# EAGLE design 4-port (EAGLE 7.6.0)
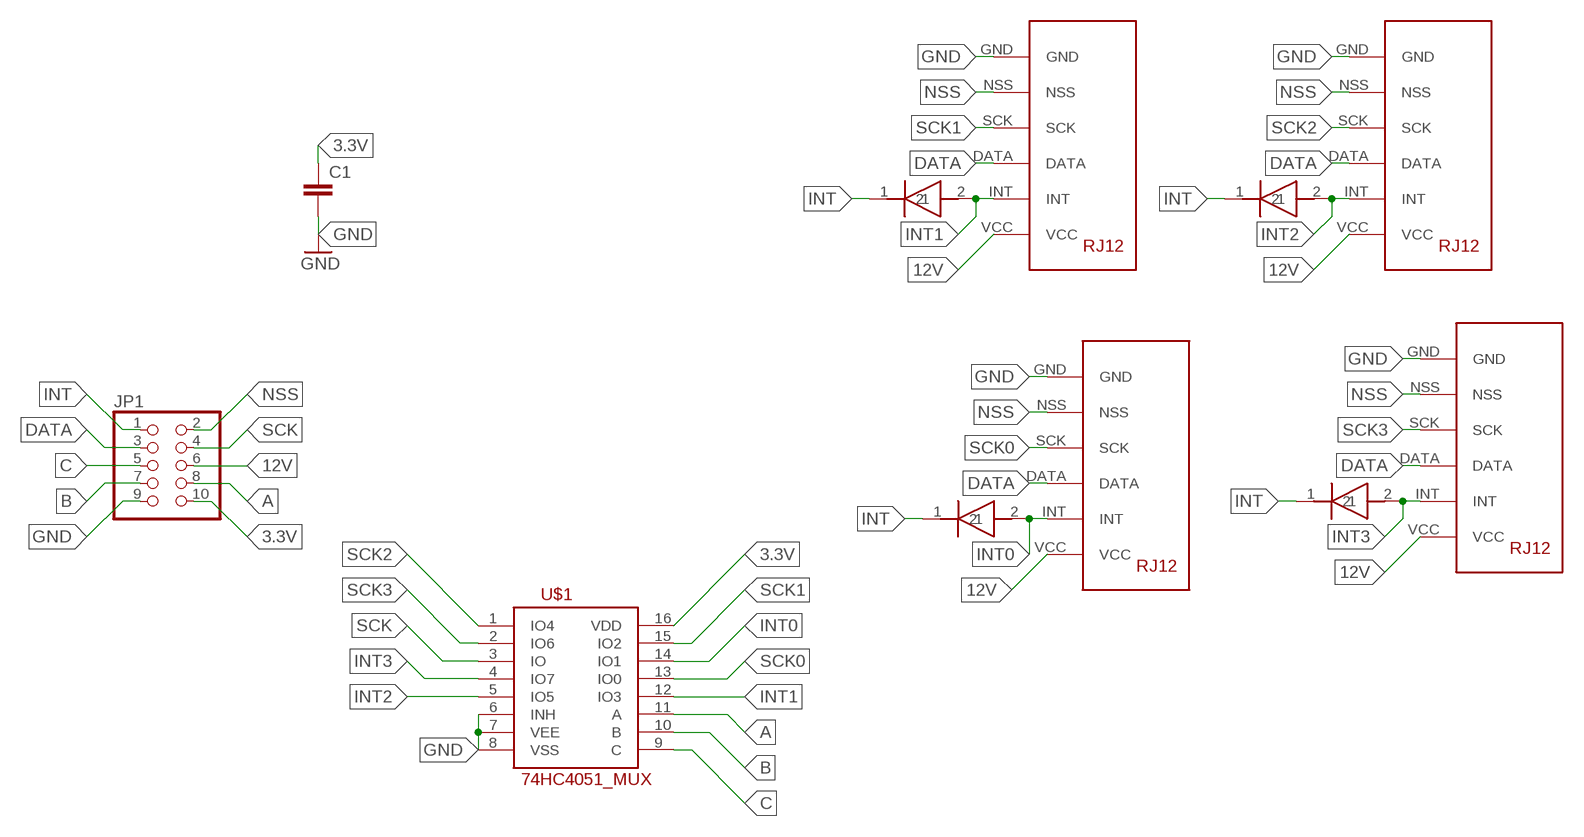
[diagram p0: schematic, sheet 1]

## Parts
C1  C-EUC1206  [C1206]
JP1  PINHD-2X5  [2X05]
U$1  74HC4051_MUX  [SO16]
U$2  RJ12SMD  [RJ12_SMD]
U$3  DIODE  [DIL_DIODE_SMD]
U$4  RJ12SMD  [RJ12_SMD]
U$5  RJ12SMD  [RJ12_SMD]
U$6  DIODE  [DIL_DIODE_SMD]
U$7  RJ12SMD  [RJ12_SMD]
U$8  DIODE  [DIL_DIODE_SMD]
U$9  DIODE  [DIL_DIODE_SMD]

## Nets
3.3V: C1.1 JP1.10 U$1.16(VDD)
12V: JP1.6 U$2.VCC U$4.VCC U$5.VCC U$7.VCC
A: JP1.8 U$1.11(A)
B: JP1.7 U$1.10(B)
C: JP1.5 U$1.9(C)
DATA: JP1.3 U$2.DATA U$4.DATA U$5.DATA U$7.DATA
GND: C1.2 JP1.9 U$1.6(INH) U$1.7(VEE) U$1.8(VSS) U$2.GND U$4.GND U$5.GND U$7.GND
INT: JP1.1 U$3.1 U$6.1 U$8.1 U$9.1
INT0: U$1.14(IO1) U$2.INT U$3.2
INT1: U$1.12(IO3) U$4.INT U$9.2
INT2: U$1.5(IO5) U$5.INT U$6.2
INT3: U$1.4(IO7) U$7.INT U$8.2
NSS: JP1.2 U$2.NSS U$4.NSS U$5.NSS U$7.NSS
SCK: JP1.4 U$1.3(IO)
SCK0: U$1.13(IO0) U$2.SCK
SCK1: U$1.15(IO2) U$4.SCK
SCK2: U$1.1(IO4) U$5.SCK
SCK3: U$1.2(IO6) U$7.SCK

## Library data of the parts
C1 = resistor:C-EU: CAPACITOR, European symbol
JP1 = pinhead:PINHD-2X5: PIN HEADER
U$1 = SparkFun-AnalogIC:74HC4051_MUX: 8:1 analog mux
U$2 U$4 U$5 U$7 = gumyns:RJ12
U$3 U$6 U$8 U$9 = gumyns:DIODE

## Board
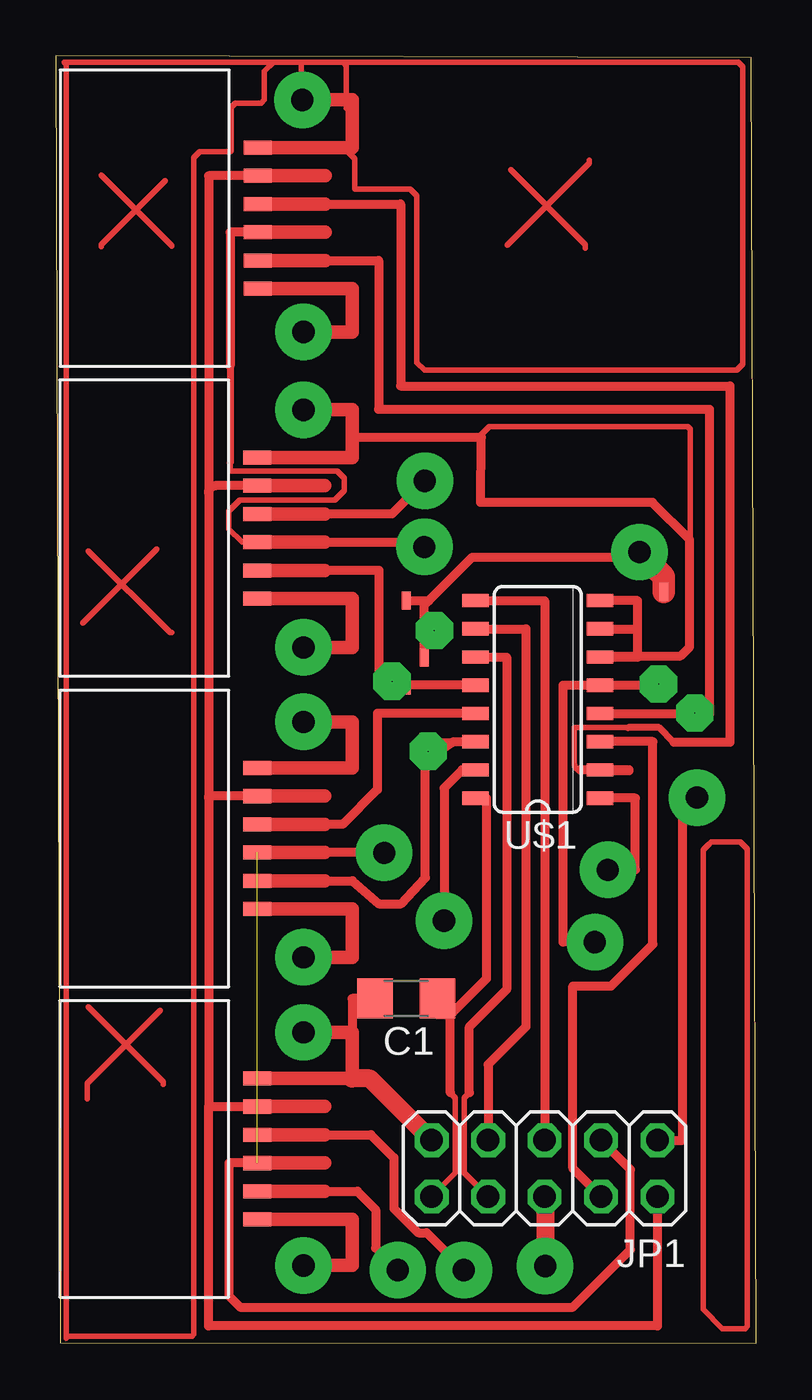
[diagram p1: board, top side]
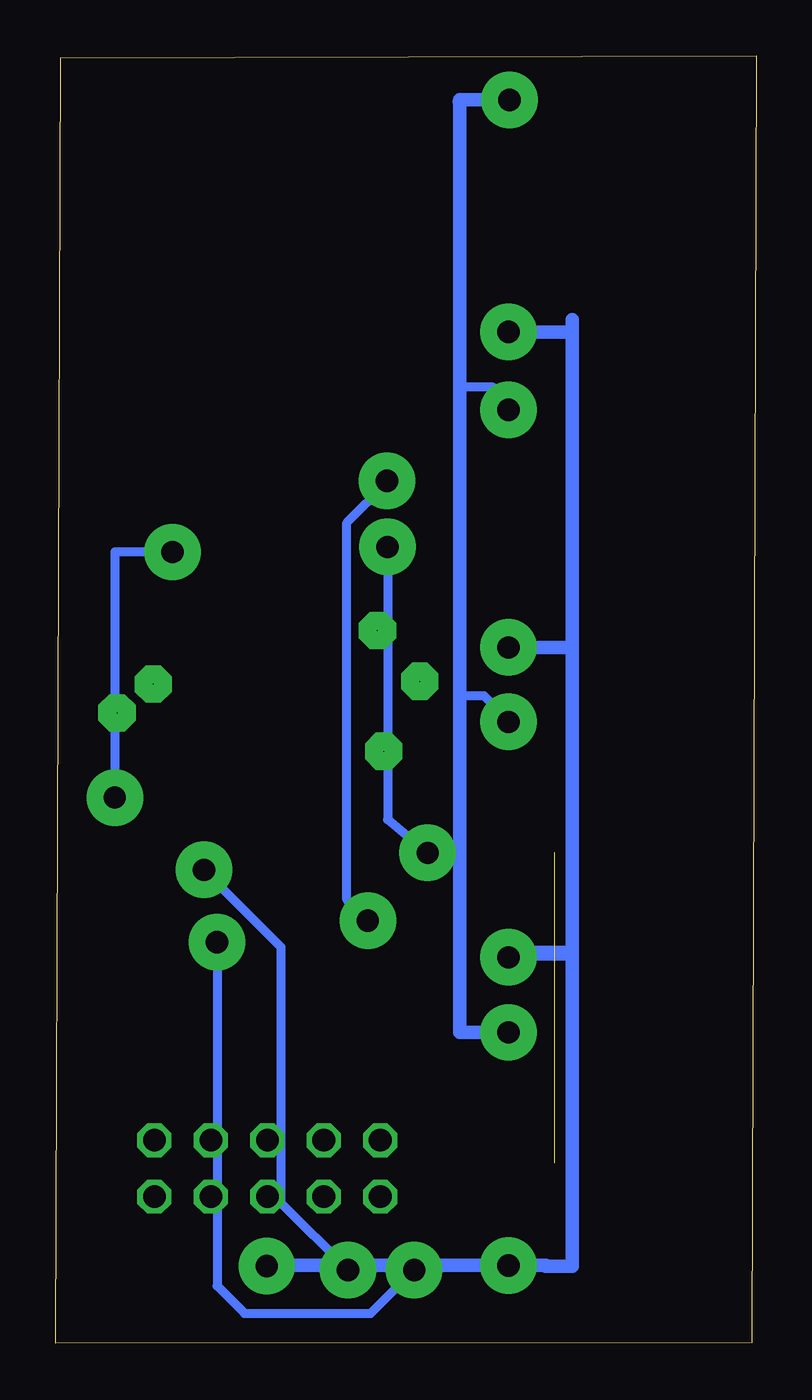
[diagram p2: board, bottom side, seen from below]

Size 31.52 x 57.95 mm. Coordinates in mm from the lower left corner, seen from the top.
Outline: 0.2,0.03 31.52,0 31.29,57.85 0,57.95 0.2,0.03
Copper layers (1*16): Top 0.035mm / dielectric 1.5mm / Bottom 0.035mm
Design rules "default": minimum track width 10mil, minimum drill 24mil, track to track 8mil, track to pad 8mil, pad to pad 8mil, via to via 8mil, smd to smd 8mil, copper to edge 40mil, drill to drill 8mil, minimum pad ring 10mil, minimum via ring 8mil, stop-mask expansion 4mil, vias tented up to drill 0mil, thermal gap 10mil

### Footprints (pad centres in the part's own frame; a part is rotated, then mirrored left to right if it is on the bottom)
C1206 = smd 1.6 x 1.8: 1 -1.4,0; 2 1.4,0
2X05 = drill 1.016 octagon: 1 -5.08,-1.27; 2 -5.08,1.27; 3 -2.54,-1.27; 4 -2.54,1.27; 5 0,-1.27; 6 0,1.27; 7 2.54,-1.27; 8 2.54,1.27; 9 5.08,-1.27; 10 5.08,1.27
SO16 = smd 0.6 x 1.2: 1 -4.445,-2.8; 2 -3.175,-2.8; 3 -1.905,-2.8; 4 -0.635,-2.8; 5 0.635,-2.8; 6 1.905,-2.8; 7 3.175,-2.8; 8 4.445,-2.8; 9 4.445,2.8; 10 3.175,2.8; 11 1.905,2.8; 12 0.635,2.8; 13 -0.635,2.8; 14 -1.905,2.8; 15 -3.175,2.8; 16 -4.445,2.8
RJ12_SMD = smd 0.635 x 1.27: DATA 0.953,5.08; GND -2.857,5.08; INT 2.223,5.08; NSS -1.587,5.08; SCK -0.318,5.08; VCC 3.493,5.08
DIL_DIODE_SMD = smd 0.406 x 0.813: 1 0,2.54; 2 0,-1.27

### Placement (x,y rotation side)
C1  15.77,15.52 180 top
JP1  22,7.87 180 top
U$1  21.69,28.98 90 top
U$2  3.99,23.04 270 top
U$3  16.59,28.32 0 top
U$4  3.99,37.01 270 top
U$5  3.99,9.07 270 top
U$6  27.36,31.27 0 top
U$7  4.01,50.95 270 top
U$8  28.22,27.05 180 top
U$9  15.77,30.89 0 top

### Tracks (layer width: path | path; a pad name or v marks a point on that pad's centre or on a via)
3.3V
  Top 0.254: JP1.10 17.98,7.67 17.98,11.05 17.75,11.28
  Top 0.406: U$1.16 19.38,24.54 19.38,16.41 17.75,14.78 | 17.75,11.28 17.75,14.78 | 17.75,14.78 17.17,14.78 C1.1
12V  (via drill 1 pad 2.54)
  Top 0.61: v11.15,3.5 13.33,3.5 13.33,5.58 12.12,5.58 | v11.15,17.37 13.33,17.37 13.33,19.55 12.12,19.55 | v11.15,31.32 13.33,31.32 13.33,33.52 12.12,33.52 | v11.15,45.52 13.33,45.52 13.33,47.46 12.14,47.46
  Top 0.813: JP1.6 22.02,6.58 v22.02,3.48
  Bottom 0.406: v11.15,31.32 8.28,31.32 8.28,31.47
  Bottom 0.61: 8.28,17.6 8.28,3.48 9.47,3.48 9.47,3.5 v11.15,3.5 22.02,3.5 v22.02,3.48 | 8.28,17.6 8.28,31.47 8.28,45.52 | 8.28,46.08 8.28,45.52 | 8.28,45.52 v11.15,45.52 | 8.41,17.53 11.15,17.53 v11.15,17.37 | 8.38,31.32 v11.15,31.32 11.18,31.32 | 11.15,17.3 v11.15,17.37 | v11.15,17.37 11.15,17.6 8.28,17.6
A
  Top 0.254: JP1.8 18.39,7.67 18.39,11.05 18.62,11.28
  Top 0.406: U$1.11 20.29,30.89 20.29,15.93 18.62,14.25 18.62,11.28
B
  Top 0.406: U$1.10 21.16,32.16 21.16,14.25 19.46,12.55 JP1.7
C
  Top 0.406: U$1.9 22,33.43 JP1.5
DATA  (via drill 1 pad 2.54)  (1 unrouted)
  Top 0.254: 7.85,39.62 7.85,39.24 12.67,39.24 12.98,38.94 12.98,38.38 12.55,37.95 8.28,37.95 7.8,37.46 7.8,36.65 8.39,36.06 U$4.DATA
  Top 0.305: 7.85,43.99 7.85,39.62
  Top 0.406: v14.78,22.07 15.1,22.08 12.12,22.08 | 12.12,36.06 16.37,36.06 arc-90 v16.59,35.84 | U$5.DATA 7.8,8.12 7.8,2.13 8.31,1.63 23.27,1.63 25.86,4.22 25.86,7.82 JP1.3 | U$7.DATA 7.85,50 7.85,43.99
  Bottom 0.406: v16.59,35.84 16.59,23.57 v14.78,22.07
GND  (via drill 1 pad 2.54)
  Top 0.406: 13.33,55.12 13.33,55.55 | 26.19,32.16 26.19,30.89 U$1.6 24.54,30.94 28.12,30.94 28.52,31.34 28.52,36.17 26.85,37.85 19.13,37.85 19.15,40.77 13.33,40.77 | 26.19,32.16 26.19,33.43 U$1.8 | U$1.7 26.19,32.16 | C1.2 13.33,15.52 13.33,13.41
  Top 0.61: 12.14,53.81 13.33,53.81 13.33,55.55 13.33,55.96 v11.1,55.96 | 12.12,39.86 13.33,39.86 13.33,40.77 13.33,42.01 v11.15,42.01 | 12.12,25.9 13.33,25.9 13.33,27.97 v11.15,27.97 | v11.15,14 13.33,14 13.33,13.41 13.33,11.92 12.12,11.92
  Top 0.813: JP1.9 14.13,11.92 13.33,11.92
  Bottom 0.406: 13.33,43.03 11.84,43.03 11.12,42.32 11.15,42.32 v11.15,42.01 | 13.33,29.13 12.24,29.13 11.25,28.14 11.15,28.14 v11.15,27.97
  Bottom 0.61: 13.36,55.88 13.33,55.88 | 13.33,55.88 13.33,43.03 13.33,29.13 13.33,14 v11.15,14 | 13.33,55.88 13.33,55.96 v11.1,55.96
INT  (via drill 1 pad 2.54)
  Top 0.406: U$3.1 16.59,33.22 16.79,33.43 | 16.79,33.43 18.74,35.38 25.5,35.38 | U$9.1 16.79,33.43 | JP1.1 28.22,9.14 U$8.1 28.22,24.56 v28.85,24.56 | 25.7,35.38 25.5,35.38 | 25.5,35.38 25.5,35.18 26.26,35.18 v26.26,35.61
  Top 1.016: U$6.1 27.36,34.52 v26.26,35.61
  Bottom 0.406: v26.26,35.61 28.85,35.61 v28.85,24.56
INT0
  Top 0.406: 12.12,20.81 13.35,20.81 14.53,19.79 15.54,19.79 16.64,20.95 16.64,26.21 17.88,27.06 | 17.88,27.06 17.91,27.08 U$1.14 | U$3.2 17.88,27.05 17.88,27.06
INT1
  Top 0.406: U$1.12 15.9,29.62 U$9.2 14.55,29.62 14.55,34.78 12.12,34.78
INT2  (via drill 1 pad 2.54)
  Top 0.406: 12.12,6.84 13.58,6.84 14.4,6.02 14.4,4.29 v15.39,3.3 | v24.26,18.06 22.83,18.06 22.83,29.62 U$1.5 27.61,29.62 U$6.2
  Bottom 0.406: v24.26,18.06 24.26,2.59 23.01,1.35 17.35,1.35 v15.39,3.3
INT3
  Top 0.406: U$1.4 28.19,28.35 U$8.2 29.41,28.32 29.41,42.04 14.53,42.04 14.53,48.73 12.14,48.73
N$2  (via drill 0.04 pad 1.68)
  other vias: 16.76,26.64
N$3  (via drill 0.04 pad 1.68)
  other vias: 15.14,29.79
N$4  (via drill 0.04 pad 1.68)
  other vias: 17.04,32.08
N$5  (via drill 0.04 pad 1.68)
  other vias: 27.13,29.67
N$6  (via drill 0.04 pad 1.68)
  other vias: 28.75,28.37
N$7
  Top 0.254: 19.08,40.82 19.51,41.25 28.45,41.25 28.55,41.15 28.55,36.22
N$8
  Top 0.254: 13.08,53.7 13.46,53.31 13.46,51.97 13.49,51.94 15.95,51.94 16.26,51.64 16.26,44.14 16.61,43.79 30.63,43.79 30.91,44.07 30.91,57.45 30.71,57.66 9.96,57.66 9.8,57.66 | 9.8,57.66 0.38,57.66 0.48,57.56 0.48,0.23 0.58,0.33 6.15,0.33 6.22,0.41 6.22,53.37 6.48,53.62 7.85,53.62 7.9,53.67 7.9,55.63 8.08,55.8 9.25,55.8 9.4,55.96 9.4,57.25 9.8,57.66
N$9
  Top 0.254: 11.1,57.63 11.05,57.58 11.05,55.93
N$10
  Top 0.254: 12.95,57.61 13.08,57.48 13.08,55.57
N$11
  Top 0.254: 20.47,52.81 23.82,49.45 23.82,49.28
N$12
  Top 0.254: 20.32,49.43 24,53.11 24,53.24
N$13
  Top 0.254: 2.06,52.58 5.23,49.4 5.23,49.38
N$14
  Top 0.254: 4.93,52.32 2.06,49.45 2.06,49.35
N$15
  Top 0.254: 1.47,35.66 5.16,31.98 5.23,31.98
N$16
  Top 0.254: 4.55,35.74 1.22,32.41
N$17
  Top 0.254: 4.7,14.99 1.42,11.71 1.42,11
N$18
  Top 0.254: 1.47,15.14 4.85,11.76 4.85,11.66
N$19
  Top 0.254: 29.41,22.48 29.13,22.2 29.13,1.52 30,0.66 31.01,0.66 31.11,0.76 31.11,22.25 30.81,22.55 29.49,22.55
NSS
  Top 0.406: U$7.NSS 6.88,52.54 6.88,38.28 | 6.88,38.28 6.88,24.56 | 6.88,24.56 6.88,10.65 | 6.88,10.65 U$5.NSS | U$4.NSS 7.2,38.6 arc90 6.88,38.28 | U$2.NSS 6.95,24.62 arc90 6.88,24.56 | JP1.2 27.08,0.79 6.88,0.79 6.88,10.65
SCK
  Top 0.406: JP1.4 23.27,7.87 23.27,16.08 24.99,16.08 26.87,17.96 26.87,27.08 U$1.3
SCK0
  Top 0.406: U$1.13 14.48,28.35 14.48,24.92 12.92,23.35 12.12,23.35
SCK1  (via drill 1 pad 2.54)
  Top 0.406: U$1.15 18.29,25.81 17.47,24.99 v17.47,19.02 | v16.61,38.81 15.13,37.32 12.12,37.32
  Bottom 0.406: v17.47,19.02 18.41,19.96 18.41,36.93 16.61,38.73 v16.61,38.81
SCK2  (via drill 1 pad 2.54)
  Top 0.406: 12.12,9.39 14.19,9.39 15.21,8.36 15.21,6.07 16.31,4.98 16.69,4.98 v18.36,3.3 | v24.84,21.31 26.09,21.31 26.09,24.54 U$1.1
  Bottom 0.406: v24.84,21.31 24.23,20.68 21.39,17.83 21.39,6.32 v18.36,3.3
SCK3
  Top 0.254: 23.6,25.81 arc-90 23.34,26.06 23.34,27.71 25.76,27.71
  Top 0.305: 27.81,27.05 27.15,27.71 25.76,27.71
  Top 0.406: U$1.2 24.49,25.78 25.81,25.78 25.81,25.81 23.6,25.81 | 12.14,51.27 15.52,51.27 15.52,43.08 30.33,43.08 30.33,27.05 27.81,27.05